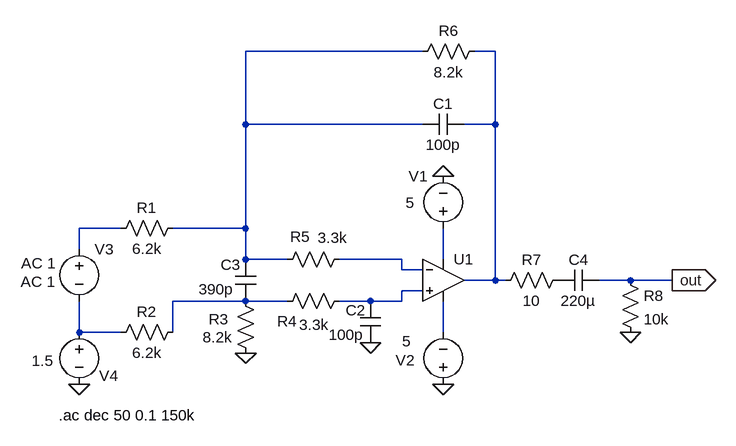
[diagram p0: schematic ES9018_DAC_outputstage.asc]
ES9018_DAC_outputstage.asc, the LTspice schematic file:
Version 4
SHEET 1 880 680
WIRE 192 -192 -80 -192
WIRE 304 -192 272 -192
WIRE -80 -80 -80 -192
WIRE 192 -80 -80 -80
WIRE 304 -80 304 -192
WIRE 304 -80 256 -80
WIRE -272 80 -336 80
WIRE -80 80 -80 -80
WIRE -80 80 -192 80
WIRE -336 112 -336 80
WIRE -80 128 -80 80
WIRE -16 128 -80 128
WIRE 160 128 64 128
WIRE 224 128 224 80
WIRE 160 144 160 128
WIRE 192 144 160 144
WIRE 304 160 304 -80
WIRE 304 160 256 160
WIRE 320 160 304 160
WIRE 512 160 464 160
WIRE 576 160 512 160
WIRE 192 176 160 176
WIRE -80 192 -192 192
WIRE -16 192 -80 192
WIRE 112 192 64 192
WIRE 160 192 160 176
WIRE 160 192 112 192
WIRE -336 240 -336 192
WIRE -272 240 -336 240
WIRE -192 240 -192 192
WIRE 224 240 224 192
FLAG 224 0 0
FLAG 224 320 0
FLAG -80 272 0
FLAG 112 256 0
FLAG -336 320 0
FLAG 512 240 0
FLAG 576 160 out
IOPIN 576 160 Out
SYMBOL voltage 224 96 R180
WINDOW 0 24 96 Left 2
WINDOW 3 44 55 Left 2
WINDOW 123 0 0 Left 2
WINDOW 39 0 0 Left 2
SYMATTR InstName V1
SYMATTR Value 5
SYMBOL voltage 224 336 R180
WINDOW 0 44 53 Left 2
WINDOW 3 50 82 Left 2
WINDOW 123 0 0 Left 2
WINDOW 39 0 0 Left 2
SYMATTR InstName V2
SYMATTR Value 5
SYMBOL cap 256 -96 R90
WINDOW 0 0 32 VBottom 2
WINDOW 3 32 32 VTop 2
SYMATTR InstName C1
SYMATTR Value 100p
SYMBOL cap 128 256 R180
WINDOW 0 23 50 Left 2
WINDOW 3 26 12 Left 2
SYMATTR InstName C2
SYMATTR Value 100p
SYMBOL cap -64 192 R180
WINDOW 0 24 56 Left 2
WINDOW 3 34 18 Left 2
SYMATTR InstName C3
SYMATTR Value 390p
SYMBOL voltage -336 96 R0
WINDOW 123 -89 38 Left 2
WINDOW 39 0 0 Left 2
WINDOW 3 -90 66 Left 2
SYMATTR Value2 AC 1
SYMATTR InstName V3
SYMATTR Value AC 1
SYMBOL res -176 64 R90
WINDOW 0 0 56 VBottom 2
WINDOW 3 32 56 VTop 2
SYMATTR InstName R1
SYMATTR Value 6.2k
SYMBOL res -176 224 R90
WINDOW 0 0 56 VBottom 2
WINDOW 3 32 56 VTop 2
SYMATTR InstName R2
SYMATTR Value 6.2k
SYMBOL res -64 288 R180
WINDOW 0 42 68 Left 2
WINDOW 3 36 40 Left 2
SYMATTR InstName R3
SYMATTR Value 8.2k
SYMBOL res -32 208 R270
WINDOW 0 -31 16 VTop 2
WINDOW 3 -5 57 VBottom 2
SYMATTR InstName R4
SYMATTR Value 3.3k
SYMBOL res -32 144 R270
WINDOW 0 35 36 VTop 2
WINDOW 3 65 86 VBottom 2
SYMATTR InstName R5
SYMATTR Value 3.3k
SYMBOL res 176 -176 R270
WINDOW 0 32 56 VTop 2
WINDOW 3 0 56 VBottom 2
SYMATTR InstName R6
SYMATTR Value 8.2k
SYMBOL Opamps\\UniversalOpamp2 224 160 R0
SYMATTR InstName U1
SYMBOL res 416 144 R90
WINDOW 0 0 56 VBottom 2
WINDOW 3 32 56 VTop 2
SYMATTR InstName R7
SYMATTR Value 10
SYMBOL cap 464 144 R90
WINDOW 0 0 32 VBottom 2
WINDOW 3 32 32 VTop 2
SYMATTR InstName C4
SYMATTR Value 220µ
SYMBOL voltage -336 224 R0
WINDOW 0 31 83 Left 2
WINDOW 3 -73 60 Left 2
WINDOW 123 0 0 Left 2
WINDOW 39 0 0 Left 2
SYMATTR InstName V4
SYMATTR Value 1.5
SYMBOL res 496 144 R0
SYMATTR InstName R8
SYMATTR Value 10k
TEXT -368 368 Left 2 !.ac dec 50 0.1 150k

The netlist it stands for:
* ES9018_DAC_outputstage.asc
V1 N005 0 5
V2 0 N009 5
C1 N002 N001 100p
C2 0 N006 100p
C3 N007 N001 390p
V3 N003 N008 AC 1 AC 1
R1 N001 N003 6.2k
R2 N007 N008 6.2k
R3 0 N007 8.2k
R4 N007 N006 3.3k
R5 N001 N004 3.3k
R6 N001 N002 8.2k
XU1 N006 N004 N005 N009 N002 level.2 Avol=1Meg GBW=10Meg Slew=10Meg ilimit=25m rail=0 Vos=0 phimargin=45 en=0 enk=0 in=0 ink=0 Rin=500Meg  ; pins IN+ IN- V+ V- OUT
R7 P001 N002 10
C4 out P001 220µ
V4 N008 0 1.5
R8 out 0 10k
.ac dec 50 0.1 150k
.lib UniversalOpamps2.sub
.backanno
.end